# Altium schematic sheet STM32F407IGH6BGA.SchDoc
size A3
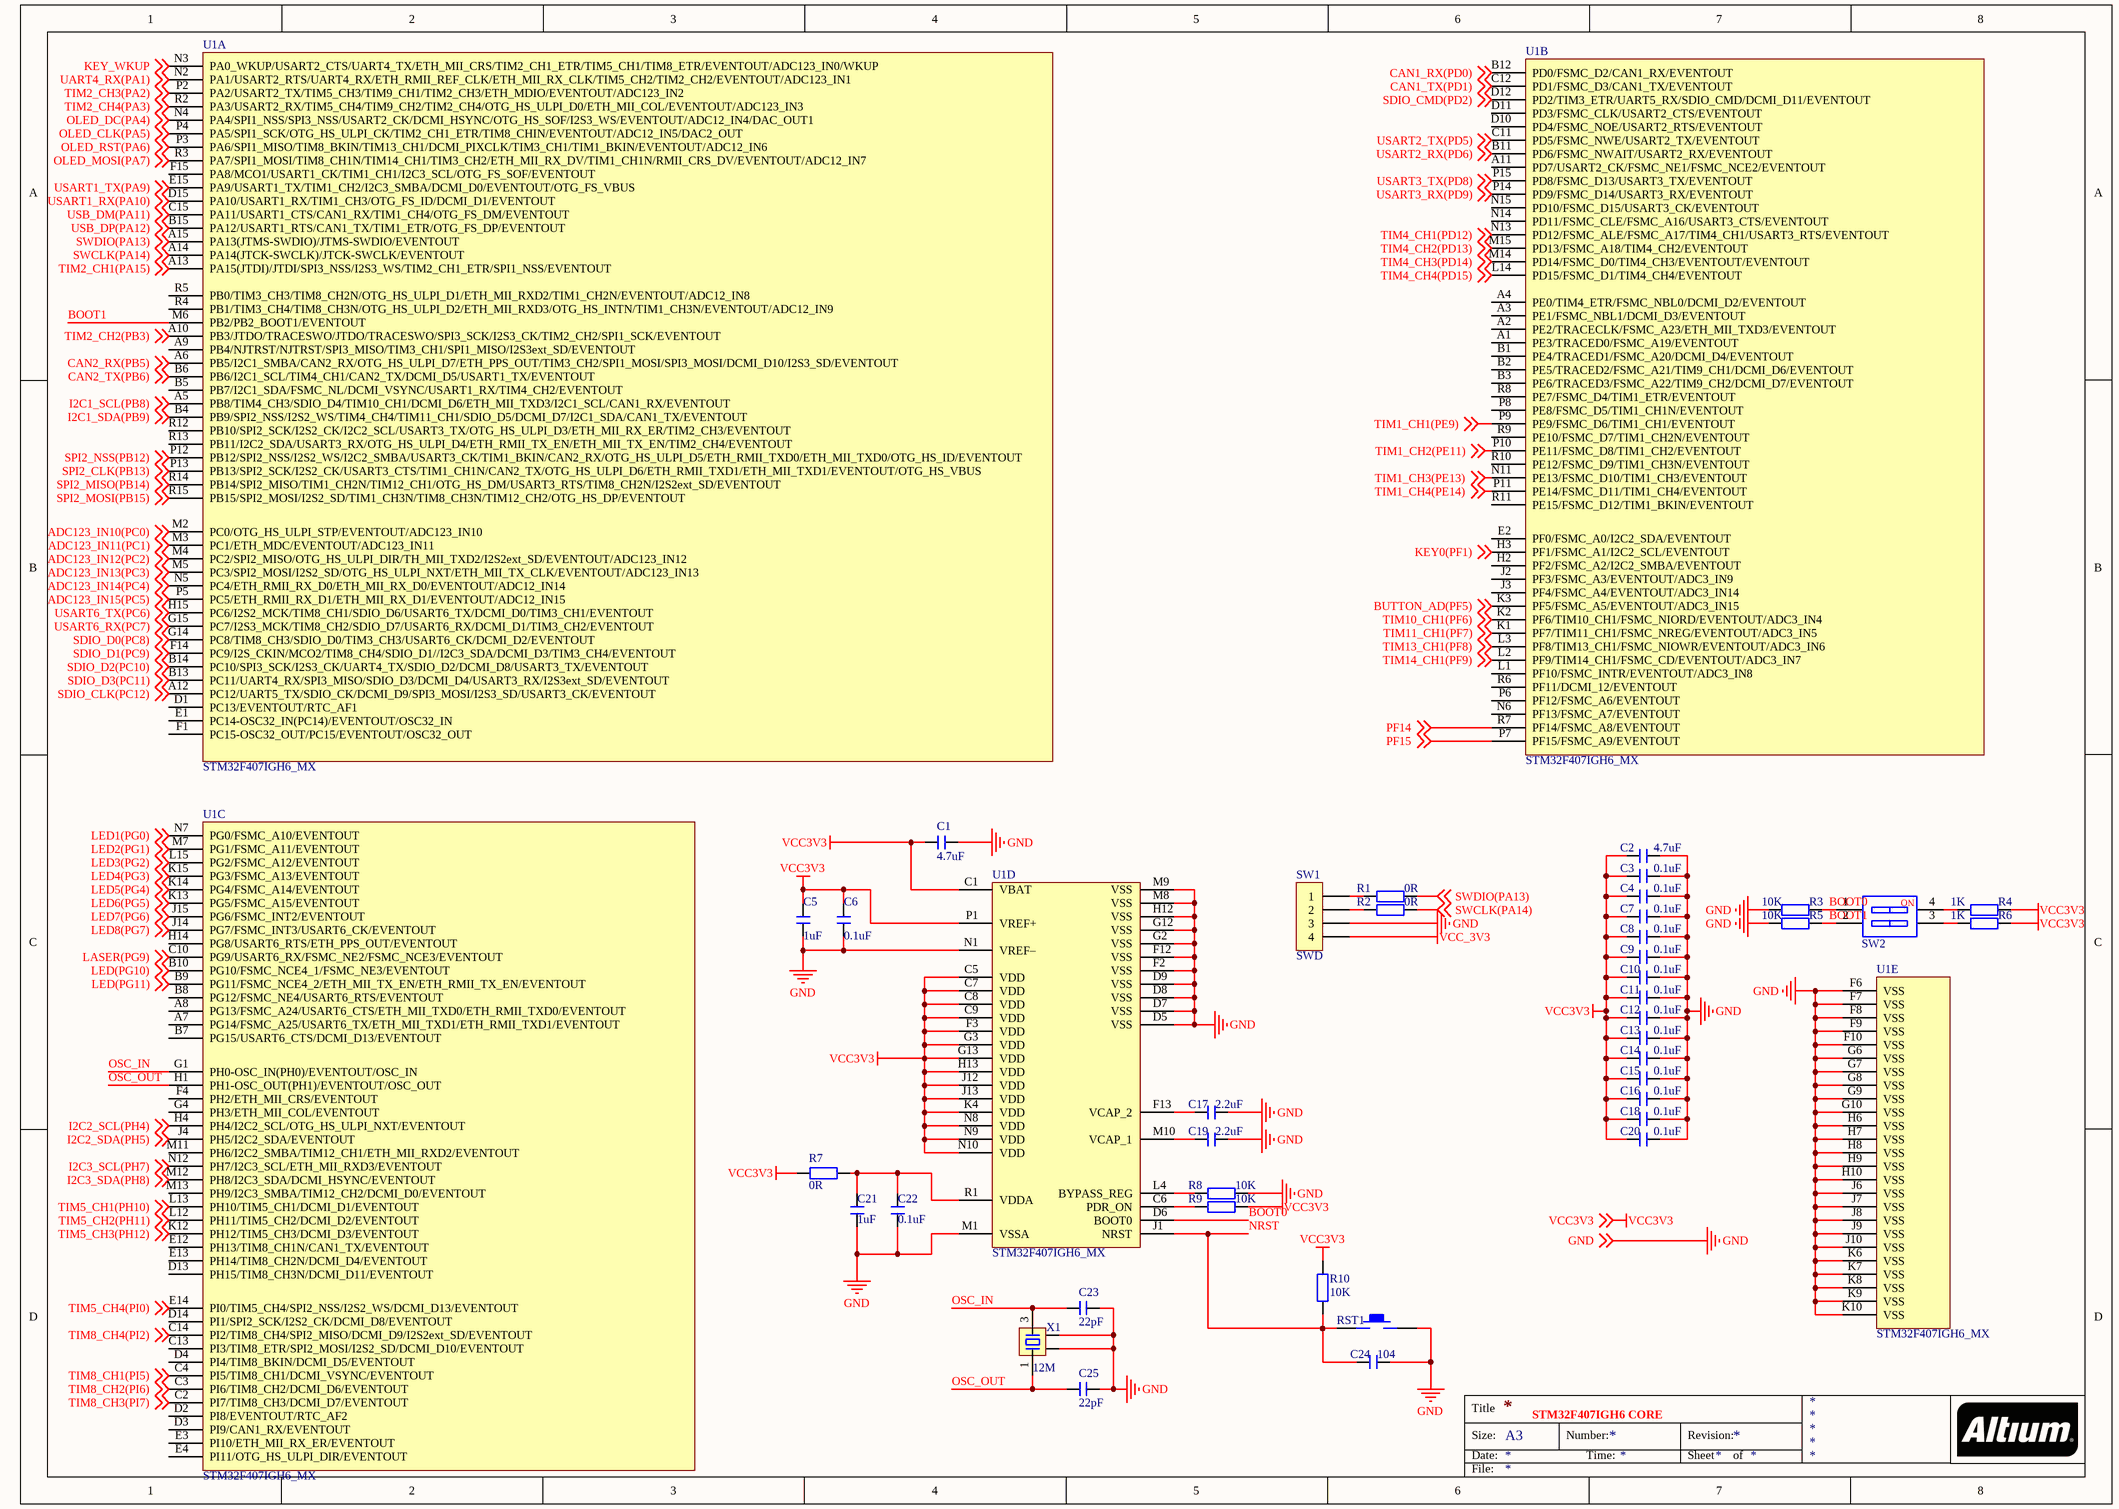
[diagram p0: STM32F407IGH6BGA.SchDoc]

## Parts
C1  4.7uF  [C 0402_M]
C2  4.7uF  [C 0402_M]
C3  0.1uF  [C 0402_M]
C4  0.1uF  [C 0402_M]
C5  1uF  [C 0402_M]
C6  0.1uF  [C 0402_M]
C7  0.1uF  [C 0402_M]
C8  0.1uF  [C 0402_M]
C9  0.1uF  [C 0402_M]
C10  0.1uF  [C 0402_M]
C11  0.1uF  [C 0402_M]
C12  0.1uF  [C 0402_M]
C13  0.1uF  [C 0402_M]
C14  0.1uF  [C 0402_M]
C15  0.1uF  [C 0402_M]
C16  0.1uF  [C 0402_M]
C17  2.2uF  [C 0402_M]
C18  0.1uF  [C 0402_M]
C19  2.2uF  [C 0402_M]
C20  0.1uF  [C 0402_M]
C21  1uF  [C 0402_M]
C22  0.1uF  [C 0402_M]
C23  22pF  [C 0402_M]
C24  104  [C 0402_M]
C25  22pF  [C 0402_M]
R1  0R  [R 0402_M]
R2  0R  [R 0402_M]
R3  10K  [R 0402_M]
R4  1K  [R 0402_M]
R5  10K  [R 0402_M]
R6  1K  [R 0402_M]
R7  0R  [R 0402_M]
R8  10K  [R 0402_M]
R9  10K  [R 0402_M]
R10  10K  [R 0402_M]
RST1  RST  [SMD-3.2*4.2]  (value not drawn)
SW1  SWD  [MX 1.25-WS-4P]
SW2  SW-2P  [CSW1.27 SMD-2P]  (value not drawn)
U1  STM32F407IGH6_MX  [UBGA-176+25]  (parts A,B,C,D,E of 5)
X1  12M  [OSC 3225-4P]

## Nets
GND: C1.1 C2.2 C3.2 C4.2 C5.1 C6.1 C7.2 C8.2 C9.2 C10.2 C11.2 C12.2 C13.2 C14.2 C15.2 C16.2 C17.2 C18.2 C19.2 C20.2 C21.1 C22.1 C23.2 C24.2 C25.2 R3.1 R5.1 R8.2 RST1.2 SW1.3 U1.D5(VSS) U1.D7(VSS) U1.D8(VSS) U1.D9(VSS) U1.F2(VSS) U1.F6(VSS) U1.F7(VSS) U1.F8(VSS) U1.F9(VSS) U1.F10(VSS) U1.F12(VSS) U1.G2(VSS) U1.G6(VSS) U1.G7(VSS) U1.G8(VSS) U1.G9(VSS) U1.G10(VSS) U1.G12(VSS) U1.H6(VSS) U1.H7(VSS) U1.H8(VSS) U1.H9(VSS) U1.H10(VSS) U1.H12(VSS) U1.J6(VSS) U1.J7(VSS) U1.J8(VSS) U1.J9(VSS) U1.J10(VSS) U1.K6(VSS) U1.K7(VSS) U1.K8(VSS) U1.K9(VSS) U1.K10(VSS) U1.M1(VSSA) U1.M8(VSS) U1.M9(VSS) U1.N1(VREF–) X1.2 X1.4 ; off-sheet GND
VCC3V3: C1.2 C2.1 C3.1 C4.1 C5.2 C6.2 C7.1 C8.1 C9.1 C10.1 C11.1 C12.1 C13.1 C14.1 C15.1 C16.1 C18.1 C20.1 R4.2 R6.2 R7.1 R9.2 R10.2 U1.C1(VBAT) U1.C5(VDD) U1.C7(VDD) U1.C8(VDD) U1.C9(VDD) U1.F3(VDD) U1.G3(VDD) U1.G13(VDD) U1.H13(VDD) U1.J12(VDD) U1.J13(VDD) U1.K4(VDD) U1.N8(VDD) U1.N9(VDD) U1.N10(VDD) U1.P1(VREF+) ; off-sheet VCC3V3
VCC_3V3: SW1.4
ADC123_IN10(PC0): U1.M2(PC0/OTG_HS_ULPI_STP/EVENTOUT/ADC123_IN10) ; off-sheet ADC123_IN10(PC0)
ADC123_IN11(PC1): U1.M3(PC1/ETH_MDC/EVENTOUT/ADC123_IN11) ; off-sheet ADC123_IN11(PC1)
ADC123_IN12(PC2): U1.M4(PC2/SPI2_MISO/OTG_HS_ULPI_DIR/TH_MII_TXD2/I2S2ext_SD/EVENTOUT/ADC123_IN12) ; off-sheet ADC123_IN12(PC2)
ADC123_IN13(PC3): U1.M5(PC3/SPI2_MOSI/I2S2_SD/OTG_HS_ULPI_NXT/ETH_MII_TX_CLK/EVENTOUT/ADC123_IN13) ; off-sheet ADC123_IN13(PC3)
ADC123_IN14(PC4): U1.N5(PC4/ETH_RMII_RX_D0/ETH_MII_RX_D0/EVENTOUT/ADC12_IN14) ; off-sheet ADC123_IN14(PC4)
ADC123_IN15(PC5): U1.P5(PC5/ETH_RMII_RX_D1/ETH_MII_RX_D1/EVENTOUT/ADC12_IN15) ; off-sheet ADC123_IN15(PC5)
BOOT0: R3.2 SW2.1 U1.D6(BOOT0)
BOOT1: R5.2 SW2.2 U1.M6(PB2/PB2_BOOT1/EVENTOUT)
BUTTON_AD(PF5): U1.K3(PF5/FSMC_A5/EVENTOUT/ADC3_IN15) ; off-sheet BUTTON_AD(PF5)
CAN1_RX(PD0): U1.B12(PD0/FSMC_D2/CAN1_RX/EVENTOUT) ; off-sheet CAN1_RX(PD0)
CAN1_TX(PD1): U1.C12(PD1/FSMC_D3/CAN1_TX/EVENTOUT) ; off-sheet CAN1_TX(PD1)
CAN2_RX(PB5): U1.A6(PB5/I2C1_SMBA/CAN2_RX/OTG_HS_ULPI_D7/ETH_PPS_OUT/TIM3_CH2/SPI1_MOSI/SPI3_MOSI/DCMI_D10/I2S3_SD/EVENTOUT) ; off-sheet CAN2_RX(PB5)
CAN2_TX(PB6): U1.B6(PB6/I2C1_SCL/TIM4_CH1/CAN2_TX/DCMI_D5/USART1_TX/EVENTOUT) ; off-sheet CAN2_TX(PB6)
I2C1_SCL(PB8): U1.A5(PB8/TIM4_CH3/SDIO_D4/TIM10_CH1/DCMI_D6/ETH_MII_TXD3/I2C1_SCL/CAN1_RX/EVENTOUT) ; off-sheet I2C1_SCL(PB8)
I2C1_SDA(PB9): U1.B4(PB9/SPI2_NSS/I2S2_WS/TIM4_CH4/TIM11_CH1/SDIO_D5/DCMI_D7/I2C1_SDA/CAN1_TX/EVENTOUT) ; off-sheet I2C1_SDA(PB9)
I2C2_SCL(PH4): U1.H4(PH4/I2C2_SCL/OTG_HS_ULPI_NXT/EVENTOUT) ; off-sheet I2C2_SCL(PH4)
I2C2_SDA(PH5): U1.J4(PH5/I2C2_SDA/EVENTOUT) ; off-sheet I2C2_SDA(PH5)
I2C3_SCL(PH7): U1.N12(PH7/I2C3_SCL/ETH_MII_RXD3/EVENTOUT) ; off-sheet I2C3_SCL(PH7)
I2C3_SDA(PH8): U1.M12(PH8/I2C3_SDA/DCMI_HSYNC/EVENTOUT) ; off-sheet I2C3_SDA(PH8)
KEY0(PF1): U1.H3(PF1/FSMC_A1/I2C2_SCL/EVENTOUT) ; off-sheet KEY0(PF1)
KEY_WKUP: U1.N3(PA0_WKUP/USART2_CTS/UART4_TX/ETH_MII_CRS/TIM2_CH1_ETR/TIM5_CH1/TIM8_ETR/EVENTOUT/ADC123_IN0/WKUP) ; off-sheet KEY_WKUP
LASER(PG9): U1.C10(PG9/USART6_RX/FSMC_NE2/FSMC_NCE3/EVENTOUT) ; off-sheet LASER(PG9)
LED1(PG0): U1.N7(PG0/FSMC_A10/EVENTOUT) ; off-sheet LED1(PG0)
LED2(PG1): U1.M7(PG1/FSMC_A11/EVENTOUT) ; off-sheet LED2(PG1)
LED3(PG2): U1.L15(PG2/FSMC_A12/EVENTOUT) ; off-sheet LED3(PG2)
LED4(PG3): U1.K15(PG3/FSMC_A13/EVENTOUT) ; off-sheet LED4(PG3)
LED5(PG4): U1.K14(PG4/FSMC_A14/EVENTOUT) ; off-sheet LED5(PG4)
LED6(PG5): U1.K13(PG5/FSMC_A15/EVENTOUT) ; off-sheet LED6(PG5)
LED7(PG6): U1.J15(PG6/FSMC_INT2/EVENTOUT) ; off-sheet LED7(PG6)
LED8(PG7): U1.J14(PG7/FSMC_INT3/USART6_CK/EVENTOUT) ; off-sheet LED8(PG7)
LED(PG10): U1.B10(PG10/FSMC_NCE4_1/FSMC_NE3/EVENTOUT) ; off-sheet LED(PG10)
LED(PG11): U1.B9(PG11/FSMC_NCE4_2/ETH_MII_TX_EN/ETH_RMII_TX_EN/EVENTOUT) ; off-sheet LED(PG11)
NRST: C24.1 R10.1 RST1.1 U1.J1(NRST)
OLED_CLK(PA5): U1.P4(PA5/SPI1_SCK/OTG_HS_ULPI_CK/TIM2_CH1_ETR/TIM8_CHIN/EVENTOUT/ADC12_IN5/DAC2_OUT) ; off-sheet OLED_CLK(PA5)
OLED_DC(PA4): U1.N4(PA4/SPI1_NSS/SPI3_NSS/USART2_CK/DCMI_HSYNC/OTG_HS_SOF/I2S3_WS/EVENTOUT/ADC12_IN4/DAC_OUT1) ; off-sheet OLED_DC(PA4)
OLED_MOSI(PA7): U1.R3(PA7/SPI1_MOSI/TIM8_CH1N/TIM14_CH1/TIM3_CH2/ETH_MII_RX_DV/TIM1_CH1N/RMII_CRS_DV/EVENTOUT/ADC12_IN7) ; off-sheet OLED_MOSI(PA7)
OLED_RST(PA6): U1.P3(PA6/SPI1_MISO/TIM8_BKIN/TIM13_CH1/DCMI_PIXCLK/TIM3_CH1/TIM1_BKIN/EVENTOUT/ADC12_IN6) ; off-sheet OLED_RST(PA6)
OSC_IN: C23.1 U1.G1(PH0-OSC_IN(PH0)/EVENTOUT/OSC_IN) X1.3
OSC_OUT: C25.1 U1.H1(PH1-OSC_OUT(PH1)/EVENTOUT/OSC_OUT) X1.1
PF14: U1.R7(PF14/FSMC_A8/EVENTOUT) ; off-sheet PF14
PF15: U1.P7(PF15/FSMC_A9/EVENTOUT) ; off-sheet PF15
SDIO_CLK(PC12): U1.A12(PC12/UART5_TX/SDIO_CK/DCMI_D9/SPI3_MOSI/I2S3_SD/USART3_CK/EVENTOUT) ; off-sheet SDIO_CLK(PC12)
SDIO_CMD(PD2): U1.D12(PD2/TIM3_ETR/UART5_RX/SDIO_CMD/DCMI_D11/EVENTOUT) ; off-sheet SDIO_CMD(PD2)
SDIO_D0(PC8): U1.G14(PC8/TIM8_CH3/SDIO_D0/TIM3_CH3/USART6_CK/DCMI_D2/EVENTOUT) ; off-sheet SDIO_D0(PC8)
SDIO_D1(PC9): U1.F14(PC9/I2S_CKIN/MCO2/TIM8_CH4/SDIO_D1//I2C3_SDA/DCMI_D3/TIM3_CH4/EVENTOUT) ; off-sheet SDIO_D1(PC9)
SDIO_D2(PC10): U1.B14(PC10/SPI3_SCK/I2S3_CK/UART4_TX/SDIO_D2/DCMI_D8/USART3_TX/EVENTOUT) ; off-sheet SDIO_D2(PC10)
SDIO_D3(PC11): U1.B13(PC11/UART4_RX/SPI3_MISO/SDIO_D3/DCMI_D4/USART3_RX/I2S3ext_SD/EVENTOUT) ; off-sheet SDIO_D3(PC11)
SPI2_CLK(PB13): U1.P13(PB13/SPI2_SCK/I2S2_CK/USART3_CTS/TIM1_CH1N/CAN2_TX/OTG_HS_ULPI_D6/ETH_RMII_TXD1/ETH_MII_TXD1/EVENTOUT/OTG_HS_VBUS) ; off-sheet SPI2_CLK(PB13)
SPI2_MISO(PB14): U1.R14(PB14/SPI2_MISO/TIM1_CH2N/TIM12_CH1/OTG_HS_DM/USART3_RTS/TIM8_CH2N/I2S2ext_SD/EVENTOUT) ; off-sheet SPI2_MISO(PB14)
SPI2_MOSI(PB15): U1.R15(PB15/SPI2_MOSI/I2S2_SD/TIM1_CH3N/TIM8_CH3N/TIM12_CH2/OTG_HS_DP/EVENTOUT) ; off-sheet SPI2_MOSI(PB15)
SPI2_NSS(PB12): U1.P12(PB12/SPI2_NSS/I2S2_WS/I2C2_SMBA/USART3_CK/TIM1_BKIN/CAN2_RX/OTG_HS_ULPI_D5/ETH_RMII_TXD0/ETH_MII_TXD0/OTG_HS_ID/EVENTOUT) ; off-sheet SPI2_NSS(PB12)
SWCLK(PA14): R2.2 U1.A14(PA14(JTCK-SWCLK)/JTCK-SWCLK/EVENTOUT) ; off-sheet SWCLK(PA14)
SWDIO(PA13): R1.2 U1.A15(PA13(JTMS-SWDIO)/JTMS-SWDIO/EVENTOUT) ; off-sheet SWDIO(PA13)
TIM1_CH1(PE9): U1.P9(PE9/FSMC_D6/TIM1_CH1/EVENTOUT) ; off-sheet TIM1_CH1(PE9)
TIM1_CH2(PE11): U1.P10(PE11/FSMC_D8/TIM1_CH2/EVENTOUT) ; off-sheet TIM1_CH2(PE11)
TIM1_CH3(PE13): U1.N11(PE13/FSMC_D10/TIM1_CH3/EVENTOUT) ; off-sheet TIM1_CH3(PE13)
TIM1_CH4(PE14): U1.P11(PE14/FSMC_D11/TIM1_CH4/EVENTOUT) ; off-sheet TIM1_CH4(PE14)
TIM2_CH1(PA15): U1.A13(PA15(JTDI)/JTDI/SPI3_NSS/I2S3_WS/TIM2_CH1_ETR/SPI1_NSS/EVENTOUT) ; off-sheet TIM2_CH1(PA15)
TIM2_CH2(PB3): U1.A10(PB3/JTDO/TRACESWO/JTDO/TRACESWO/SPI3_SCK/I2S3_CK/TIM2_CH2/SPI1_SCK/EVENTOUT) ; off-sheet TIM2_CH2(PB3)
TIM2_CH3(PA2): U1.P2(PA2/USART2_TX/TIM5_CH3/TIM9_CH1/TIM2_CH3/ETH_MDIO/EVENTOUT/ADC123_IN2) ; off-sheet TIM2_CH3(PA2)
TIM2_CH4(PA3): U1.R2(PA3/USART2_RX/TIM5_CH4/TIM9_CH2/TIM2_CH4/OTG_HS_ULPI_D0/ETH_MII_COL/EVENTOUT/ADC123_IN3) ; off-sheet TIM2_CH4(PA3)
TIM4_CH1(PD12): U1.N13(PD12/FSMC_ALE/FSMC_A17/TIM4_CH1/USART3_RTS/EVENTOUT) ; off-sheet TIM4_CH1(PD12)
TIM4_CH2(PD13): U1.M15(PD13/FSMC_A18/TIM4_CH2/EVENTOUT) ; off-sheet TIM4_CH2(PD13)
TIM4_CH3(PD14): U1.M14(PD14/FSMC_D0/TIM4_CH3/EVENTOUT/EVENTOUT) ; off-sheet TIM4_CH3(PD14)
TIM4_CH4(PD15): U1.L14(PD15/FSMC_D1/TIM4_CH4/EVENTOUT) ; off-sheet TIM4_CH4(PD15)
TIM5_CH1(PH10): U1.L13(PH10/TIM5_CH1/DCMI_D1/EVENTOUT) ; off-sheet TIM5_CH1(PH10)
TIM5_CH2(PH11): U1.L12(PH11/TIM5_CH2/DCMI_D2/EVENTOUT) ; off-sheet TIM5_CH2(PH11)
TIM5_CH3(PH12): U1.K12(PH12/TIM5_CH3/DCMI_D3/EVENTOUT) ; off-sheet TIM5_CH3(PH12)
TIM5_CH4(PI0): U1.E14(PI0/TIM5_CH4/SPI2_NSS/I2S2_WS/DCMI_D13/EVENTOUT) ; off-sheet TIM5_CH4(PI0)
TIM8_CH1(PI5): U1.C4(PI5/TIM8_CH1/DCMI_VSYNC/EVENTOUT) ; off-sheet TIM8_CH1(PI5)
TIM8_CH2(PI6): U1.C3(PI6/TIM8_CH2/DCMI_D6/EVENTOUT) ; off-sheet TIM8_CH2(PI6)
TIM8_CH3(PI7): U1.C2(PI7/TIM8_CH3/DCMI_D7/EVENTOUT) ; off-sheet TIM8_CH3(PI7)
TIM8_CH4(PI2): U1.C14(PI2/TIM8_CH4/SPI2_MISO/DCMI_D9/I2S2ext_SD/EVENTOUT) ; off-sheet TIM8_CH4(PI2)
TIM10_CH1(PF6): U1.K2(PF6/TIM10_CH1/FSMC_NIORD/EVENTOUT/ADC3_IN4) ; off-sheet TIM10_CH1(PF6)
TIM11_CH1(PF7): U1.K1(PF7/TIM11_CH1/FSMC_NREG/EVENTOUT/ADC3_IN5) ; off-sheet TIM11_CH1(PF7)
TIM13_CH1(PF8): U1.L3(PF8/TIM13_CH1/FSMC_NIOWR/EVENTOUT/ADC3_IN6) ; off-sheet TIM13_CH1(PF8)
TIM14_CH1(PF9): U1.L2(PF9/TIM14_CH1/FSMC_CD/EVENTOUT/ADC3_IN7) ; off-sheet TIM14_CH1(PF9)
UART4_RX(PA1): U1.N2(PA1/USART2_RTS/UART4_RX/ETH_RMII_REF_CLK/ETH_MII_RX_CLK/TIM5_CH2/TIM2_CH2/EVENTOUT/ADC123_IN1) ; off-sheet UART4_RX(PA1)
USART1_RX(PA10): U1.D15(PA10/USART1_RX/TIM1_CH3/OTG_FS_ID/DCMI_D1/EVENTOUT) ; off-sheet USART1_RX(PA10)
USART1_TX(PA9): U1.E15(PA9/USART1_TX/TIM1_CH2/I2C3_SMBA/DCMI_D0/EVENTOUT/OTG_FS_VBUS) ; off-sheet USART1_TX(PA9)
USART2_RX(PD6): U1.B11(PD6/FSMC_NWAIT/USART2_RX/EVENTOUT) ; off-sheet USART2_RX(PD6)
USART2_TX(PD5): U1.C11(PD5/FSMC_NWE/USART2_TX/EVENTOUT) ; off-sheet USART2_TX(PD5)
USART3_RX(PD9): U1.P14(PD9/FSMC_D14/USART3_RX/EVENTOUT) ; off-sheet USART3_RX(PD9)
USART3_TX(PD8): U1.P15(PD8/FSMC_D13/USART3_TX/EVENTOUT) ; off-sheet USART3_TX(PD8)
USART6_RX(PC7): U1.G15(PC7/I2S3_MCK/TIM8_CH2/SDIO_D7/USART6_RX/DCMI_D1/TIM3_CH2/EVENTOUT) ; off-sheet USART6_RX(PC7)
USART6_TX(PC6): U1.H15(PC6/I2S2_MCK/TIM8_CH1/SDIO_D6/USART6_TX/DCMI_D0/TIM3_CH1/EVENTOUT) ; off-sheet USART6_TX(PC6)
USB_DM(PA11): U1.C15(PA11/USART1_CTS/CAN1_RX/TIM1_CH4/OTG_FS_DM/EVENTOUT) ; off-sheet USB_DM(PA11)
USB_DP(PA12): U1.B15(PA12/USART1_RTS/CAN1_TX/TIM1_ETR/OTG_FS_DP/EVENTOUT) ; off-sheet USB_DP(PA12)
NetC17_1: C17.1 U1.F13(VCAP_2)
NetC19_1: C19.1 U1.M10(VCAP_1)
NetC21_2: C21.2 C22.2 R7.2 U1.R1(VDDA)
NetR1_1: R1.1 SW1.1
NetR2_1: R2.1 SW1.2
NetR4_1: R4.1 SW2.4
NetR6_1: R6.1 SW2.3
NetR8_1: R8.1 U1.L4(BYPASS_REG)
NetR9_1: R9.1 U1.C6(PDR_ON)

Not connected (* = marked no-connect by the designer): U1 A1(PE3/TRACED0/FSMC_A19/EVENTOUT) A2(PE2/TRACECLK/FSMC_A23/ETH_MII_TXD3/EVENTOUT) A3(PE1/FSMC_NBL1/DCMI_D3/EVENTOUT) A4(PE0/TIM4_ETR/FSMC_NBL0/DCMI_D2/EVENTOUT) A7(PG14/FSMC_A25/USART6_TX/ETH_MII_TXD1/ETH_RMII_TXD1/EVENTOUT) A8(PG13/FSMC_A24/USART6_CTS/ETH_MII_TXD0/ETH_RMII_TXD0/EVENTOUT) A9(PB4/NJTRST/NJTRST/SPI3_MISO/TIM3_CH1/SPI1_MISO/I2S3ext_SD/EVENTOUT) A11(PD7/USART2_CK/FSMC_NE1/FSMC_NCE2/EVENTOUT) B1(PE4/TRACED1/FSMC_A20/DCMI_D4/EVENTOUT) B2(PE5/TRACED2/FSMC_A21/TIM9_CH1/DCMI_D6/EVENTOUT) B3(PE6/TRACED3/FSMC_A22/TIM9_CH2/DCMI_D7/EVENTOUT) B5(PB7/I2C1_SDA/FSMC_NL/DCMI_VSYNC/USART1_RX/TIM4_CH2/EVENTOUT) B7(PG15/USART6_CTS/DCMI_D13/EVENTOUT) B8(PG12/FSMC_NE4/USART6_RTS/EVENTOUT) C13(PI3/TIM8_ETR/SPI2_MOSI/I2S2_SD/DCMI_D10/EVENTOUT) D1(PC13/EVENTOUT/RTC_AF1) D2(PI8/EVENTOUT/RTC_AF2) D3(PI9/CAN1_RX/EVENTOUT) D4(PI4/TIM8_BKIN/DCMI_D5/EVENTOUT) D10(PD4/FSMC_NOE/USART2_RTS/EVENTOUT) D11(PD3/FSMC_CLK/USART2_CTS/EVENTOUT) D13(PH15/TIM8_CH3N/DCMI_D11/EVENTOUT) D14(PI1/SPI2_SCK/I2S2_CK/DCMI_D8/EVENTOUT) E1(PC14-OSC32_IN(PC14)/EVENTOUT/OSC32_IN) E2(PF0/FSMC_A0/I2C2_SDA/EVENTOUT) E3(PI10/ETH_MII_RX_ER/EVENTOUT) E4(PI11/OTG_HS_ULPI_DIR/EVENTOUT) E12(PH13/TIM8_CH1N/CAN1_TX/EVENTOUT) E13(PH14/TIM8_CH2N/DCMI_D4/EVENTOUT) F1(PC15-OSC32_OUT/PC15/EVENTOUT/OSC32_OUT) F4(PH2/ETH_MII_CRS/EVENTOUT) F15(PA8/MCO1/USART1_CK/TIM1_CH1/I2C3_SCL/OTG_FS_SOF/EVENTOUT) G4(PH3/ETH_MII_COL/EVENTOUT) H2(PF2/FSMC_A2/I2C2_SMBA/EVENTOUT) H14(PG8/USART6_RTS/ETH_PPS_OUT/EVENTOUT) J2(PF3/FSMC_A3/EVENTOUT/ADC3_IN9) J3(PF4/FSMC_A4/EVENTOUT/ADC3_IN14) L1(PF10/FSMC_INTR/EVENTOUT/ADC3_IN8) M11(PH6/I2C2_SMBA/TIM12_CH1/ETH_MII_RXD2/EVENTOUT) M13(PH9/I2C3_SMBA/TIM12_CH2/DCMI_D0/EVENTOUT) N6(PF13/FSMC_A7/EVENTOUT) N14(PD11/FSMC_CLE/FSMC_A16/USART3_CTS/EVENTOUT) N15(PD10/FSMC_D15/USART3_CK/EVENTOUT) P6(PF12/FSMC_A6/EVENTOUT) P8(PE8/FSMC_D5/TIM1_CH1N/EVENTOUT) R4(PB1/TIM3_CH4/TIM8_CH3N/OTG_HS_ULPI_D2/ETH_MII_RXD3/OTG_HS_INTN/TIM1_CH3N/EVENTOUT/ADC12_IN9) R5(PB0/TIM3_CH3/TIM8_CH2N/OTG_HS_ULPI_D1/ETH_MII_RXD2/TIM1_CH2N/EVENTOUT/ADC12_IN8) R6(PF11/DCMI_12/EVENTOUT) R8(PE7/FSMC_D4/TIM1_ETR/EVENTOUT) R9(PE10/FSMC_D7/TIM1_CH2N/EVENTOUT) R10(PE12/FSMC_D9/TIM1_CH3N/EVENTOUT) R11(PE15/FSMC_D12/TIM1_BKIN/EVENTOUT) R12(PB10/SPI2_SCK/I2S2_CK/I2C2_SCL/USART3_TX/OTG_HS_ULPI_D3/ETH_MII_RX_ER/TIM2_CH3/EVENTOUT) R13(PB11/I2C2_SDA/USART3_RX/OTG_HS_ULPI_D4/ETH_RMII_TX_EN/ETH_MII_TX_EN/TIM2_CH4/EVENTOUT)

## Notes on the sheet
- STM32F407IGH6 CORE
- Title
- Size:
- Date:
- A3
- Number:
- Time:
- Revision:
- Sheet
- of
- File:
- (in symbol SW-2P) NO

## Library data of the parts
C1-C25 = C: 贴片电容
R1-R10 = R: 贴片电阻
RST1 = KEY_M
SW1 = HDR1x4: Connector
SW2 = SW-2P: 2路编码开关
X1 = XTAL-4P: 4脚无源晶振